# Altium schematic sheet DC-DC Converters.SchDoc
size B
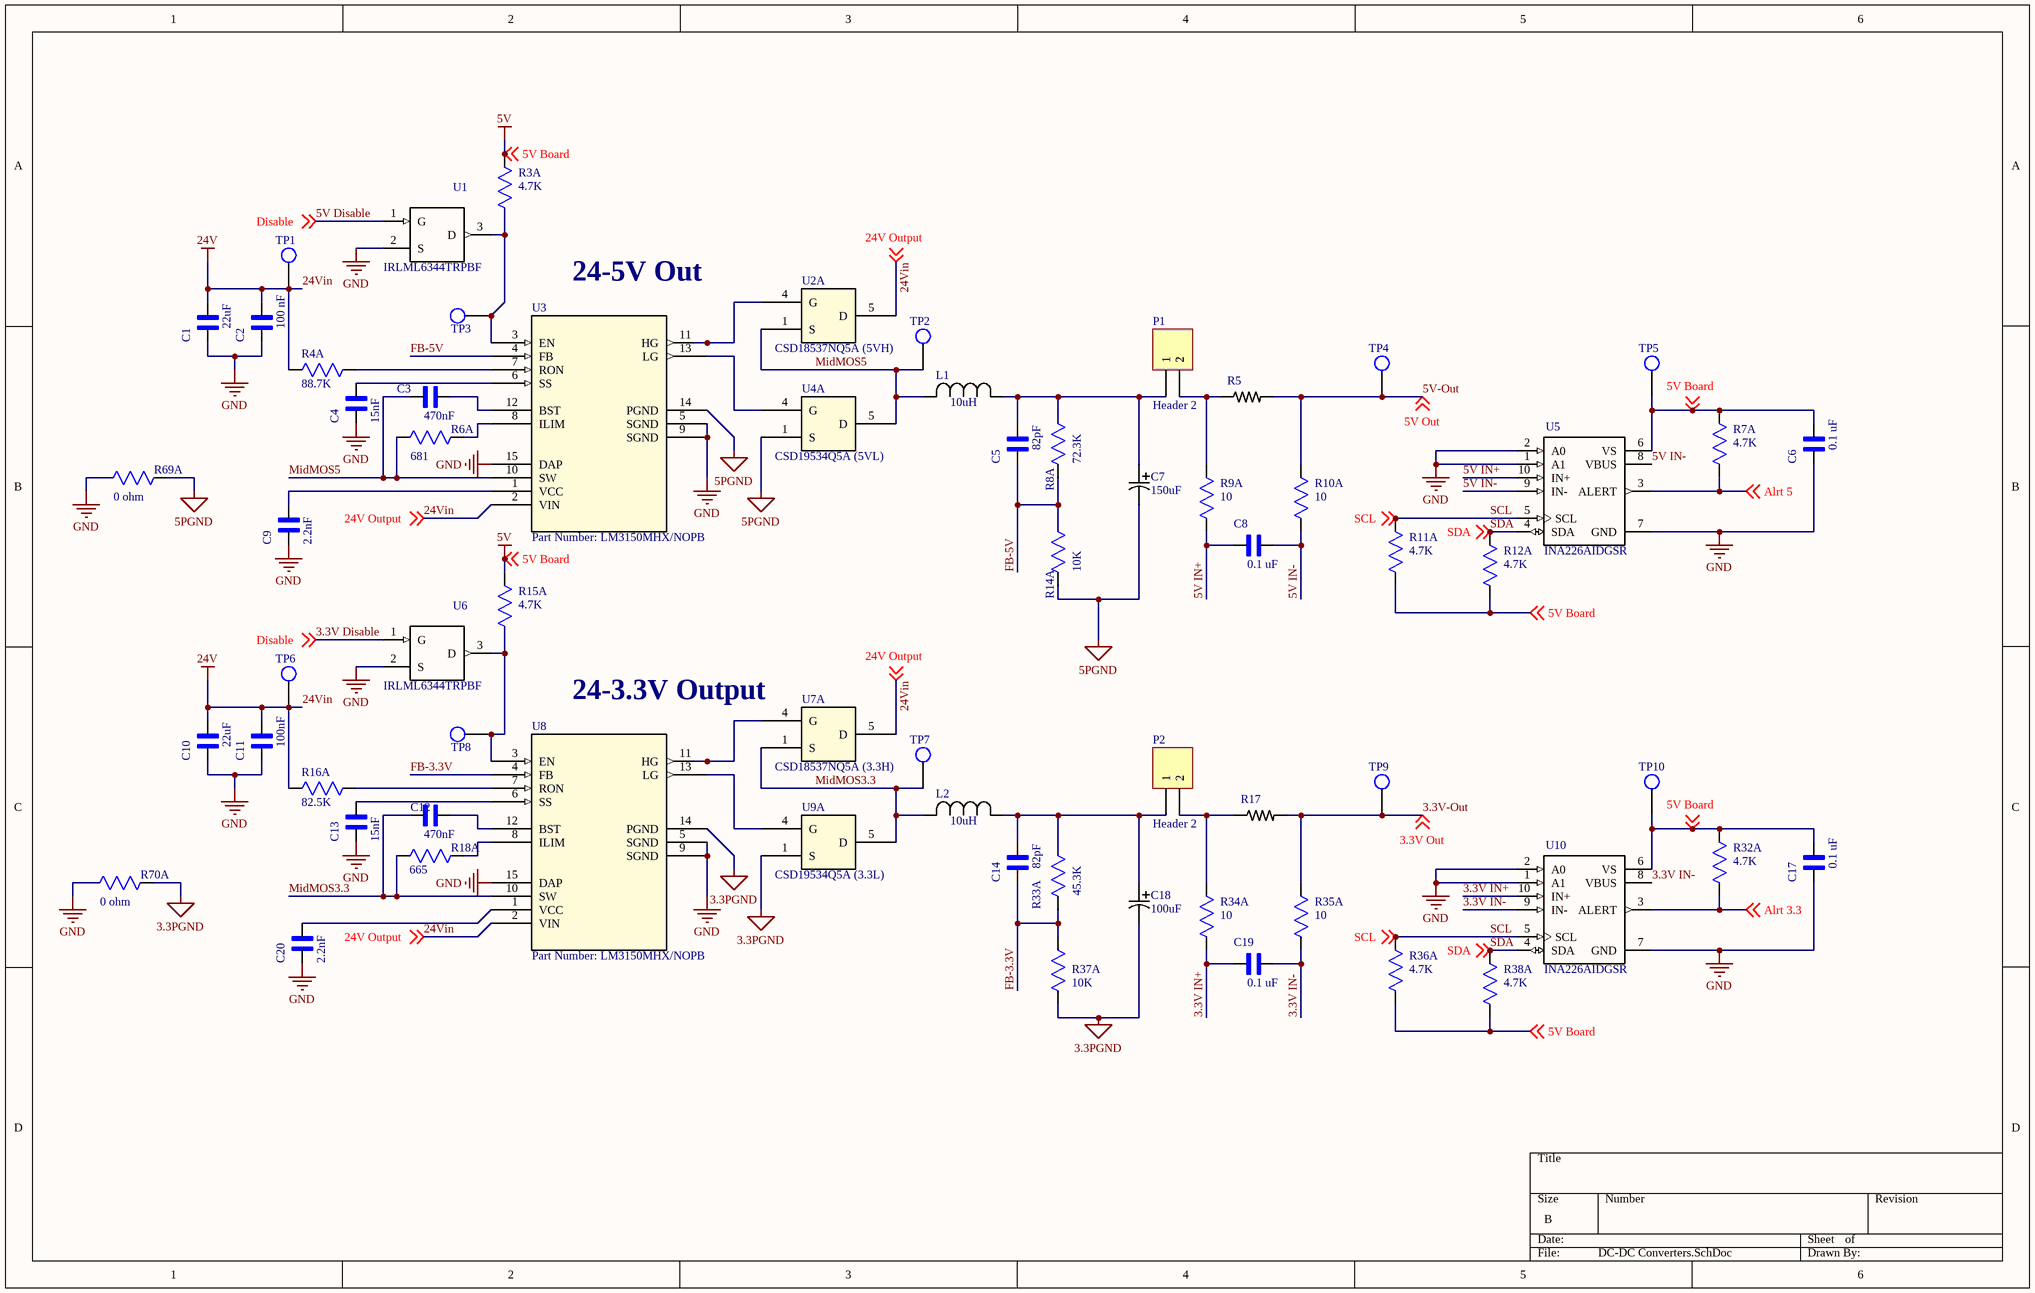
[diagram p0: DC-DC Converters.SchDoc]

## Parts
C1  22uF  [*CAPC2012X135N]
C2  100 nF  [*CAPC2012X135N]
C3  470nF  [*CAPC2012X135N]
C4  15nF  [*CAPC2012X135N]
C5  82pF  [*CAPC2012X135N]
C6  0.1 uF  [*CAPC2012X135N]
C7  150uF  [PCAP_TPE_B2]
C8  0.1 uF  [*CAPC2012X135N]
C9  2.2nF  [*CAPC2012X135N]
C10  22uF  [*CAPC2012X135N]
C11  100nF  [*CAPC2012X135N]
C12  470nF  [*CAPC2012X135N]
C13  15nF  [*CAPC2012X135N]
C14  82pF  [*CAPC2012X135N]
C17  0.1 uF  [*CAPC2012X135N]
C18  100uF  [PCAP_TPE_B2]
C19  0.1 uF  [*CAPC2012X135N]
C20  2.2nF  [*CAPC2012X135N]
L1  10uH  [IND_BOURNS_SRP12]
L2  10uH  [IND_BOURNS_SRP12]
P1  Header 2  [HDR1X2]
P2  Header 2  [HDR1X2]
R3  4.7K  [RC0805N]  (part A of 2)
R4  88.7K  [RC0805N]  (part A of 2)
R5  1-1879378-2  [*RESC6331X70N]  (value not drawn)
R6  681  [RC0805N]  (part A of 2)
R7  4.7K  [RC0805N]  (part A of 2)
R8  72.3K  [RC0805N]  (part A of 2)
R9  10  [RC0805N]  (part A of 2)
R10  10  [RC0805N]  (part A of 2)
R11  4.7K  [RC0805N]  (part A of 2)
R12  4.7K  [RC0805N]  (part A of 2)
R14  10K  [RC0805N]  (part A of 2)
R15  4.7K  [RC0805N]  (part A of 2)
R16  82.5K  [RC0805N]  (part A of 2)
R17  1-1879378-2  [*RESC6331X70N]  (value not drawn)
R18  665  [RC0805N]  (part A of 2)
R32  4.7K  [RC0805N]  (part A of 2)
R33  45.3K  [RC0805N]  (part A of 2)
R34  10  [RC0805N]  (part A of 2)
R35  10  [RC0805N]  (part A of 2)
R36  4.7K  [RC0805N]  (part A of 2)
R37  10K  [RC0805N]  (part A of 2)
R38  4.7K  [RC0805N]  (part A of 2)
R69  0 ohm  [RC0805N]  (part A of 2)
R70  0 ohm  [RC0805N]  (part A of 2)
TP1  Test Point  [Test Point Through-hole]  (value not drawn)
TP2  Test Point  [Test Point Through-hole]  (value not drawn)
TP3  Test Point  [Test Point Through-hole]  (value not drawn)
TP4  Test Point  [Test Point Through-hole]  (value not drawn)
TP5  Test Point  [Test Point Through-hole]  (value not drawn)
TP6  Test Point  [Test Point Through-hole]  (value not drawn)
TP7  Test Point  [Test Point Through-hole]  (value not drawn)
TP8  Test Point  [Test Point Through-hole]  (value not drawn)
TP9  Test Point  [Test Point Through-hole]  (value not drawn)
TP10  Test Point  [Test Point Through-hole]  (value not drawn)
U1  IRLML6344TRPBF  [*SOT95P240X112-3N]
U2  CSD18537NQ5A (5VH)  [*TRANS_BSC076N06NS3-G]  (part A of 2)
U3  Part Number: LM3150MHX/NOPB  [MXA14A]
U4  CSD19534Q5A (5VL)  [DQJ8]  (part A of 2)
U5  INA226AIDGSR  [*SOP50P490X110-10N]
U6  IRLML6344TRPBF  [*SOT95P240X112-3N]
U7  CSD18537NQ5A (3.3H)  [DQJ8]  (part A of 2)
U8  Part Number: LM3150MHX/NOPB  [MXA14A]
U9  CSD19534Q5A (3.3L)  [DQJ8]  (part A of 2)
U10  INA226AIDGSR  [*SOP50P490X110-10N]

## Nets
3.3PGND: C18.2 R70.1 U8.14(PGND) U9.1(S)
5PGND: C7.2 R14.1 R69.1 U3.14(PGND) U4.1(S)
5V: C6.2 C17.2 R3.1 R7.1 R15.1 R32.1 TP5.1 TP10.1 U5.6(VS) U10.6(VS) ; off-sheet 5V Board   [also labelled 5V Board ]
24Vin: C1.2 C2.2 C10.2 C11.2 TP1.1 TP6.1 U2.5(D) U3.2(VIN) U7.5(D) U8.2(VIN) ; off-sheet 24V Output   [also labelled 24V, 24V Output ]
GND: C1.1 C2.1 C4.1 C6.1 C9.1 C10.1 C11.1 C13.1 C17.1 C20.1 R69.2 R70.2 U1.2(S) U3.5(SGND) U3.9(SGND) U3.15(DAP) U5.1(A1) U5.2(A0) U5.7(GND) U6.2(S) U8.5(SGND) U8.9(SGND) U8.15(DAP) U10.1(A1) U10.2(A0) U10.7(GND)
3.3V Disable: U1.1(G) U6.1(G) ; off-sheet Disable   [also labelled 5V Disable, Disable ]
3.3V IN+: C19.1 U10.10(IN+)
3.3V IN-: C19.2 U10.8(VBUS) U10.9(IN-)
3.3V-Out: R17.2 R35.1 TP9.1 ; off-sheet 3.3V Out  [also labelled 3.3V Out]
5V IN+: C8.1 U5.10(IN+)
5V IN-: C8.2 U5.8(VBUS) U5.9(IN-)
5V-Out: R5.2 R10.1 TP4.1 ; off-sheet 5V Out  [also labelled 5V Out]
Alrt 3.3: U10.3(ALERT) ; off-sheet Alrt 3.3
Alrt 5: U5.3(ALERT) ; off-sheet Alrt 5
FB-3.3V: C14.1 R33.1 R37.1 U8.4(FB)
FB-5V: C5.1 R8.1 R14.2 U3.4(FB)
MidMOS3.3: C12.1 L2.2 TP7.1 U7.1(S) U8.10(SW) U9.5(D)
MidMOS5: C3.1 L1.2 TP2.1 U2.1(S) U3.10(SW) U4.5(D)
SCL: R11.1 R36.1 U5.5(SCL) U10.5(SCL) ; off-sheet SCL
SDA: R12.1 R38.1 U5.4(SDA) U10.4(SDA) ; off-sheet SDA
NetC3_2: C3.2 U3.12(BST)
NetC4_2: C4.2 U3.6(SS)
NetC5_2: C5.2 C7.1 L1.1 P1.1 R8.2
NetC9_2: C9.2 U3.1(VCC)
NetC12_2: C12.2 U8.12(BST)
NetC13_2: C13.2 U8.6(SS)
NetC14_2: C14.2 C18.1 L2.1 P2.1 R33.2
NetC20_2: C20.2 U8.1(VCC)
NetP1_2: P1.2 R5.1 R9.1
NetP2_2: P2.2 R17.1 R34.1
NetR3_2: R3.2 TP3.1 U1.3(D) U3.3(EN)
NetR4_1: R4.1 U3.7(RON)
NetR6_1: R6.1 U3.8(ILIM)
NetR15_2: R15.2 TP8.1 U6.3(D) U8.3(EN)
NetR16_1: R16.1 U8.7(RON)
NetR18_1: R18.1 U8.8(ILIM)
NetU2_4: U2.4(G) U3.11(HG)
NetU3_13: U3.13(LG) U4.4(G)
NetU7_4: U7.4(G) U8.11(HG)
NetU8_13: U8.13(LG) U9.4(G)

Not connected (* = marked no-connect by the designer): R4 2; R6 2; R7 2; R9 2; R10 2; R11 2; R12 2; R16 2; R18 2; R32 2; R34 2; R35 2; R36 2; R37 2; R38 2

## Notes on the sheet
- 24-5V Out
- (near U7) 24-3.3V Output

## Library data of the parts
C1-C6 C8-C14 C17 C19 C20 = EMK212BJ225KG-T: / Cap Ceramic 2.2uF 16V X5R 10% SMD 0805 125Â°C Embossed T/R /; MF: Taiyo Yuden; MP: EMK212BJ225KG-T; Package: 2012 Taiyo Yuden; Digi-Key_Purchase_URL: https://www.digikey.com/product-detail/en/taiyo-yuden/EMK212BJ225KG-T/587-1293-1-ND/931070?utm_source=snapeda&utm_medium=aggregator&utm_campaign=symbol; Digi-Key_Part_Number: 587-1293-1-ND; SnapEDA_Link: https://www.snapeda.com/parts/EMK212BJ225KG-T/Taiyo%20Yuden/view-part/?ref=snap; Value: *
C7 C18 = 6TPE150MAPB: No Description Available; Vendor: Panasonic; Built_By: EMA_UL_Team; Type: DEV; Manufacturer_Part_Number: 6TPE150MAPB; Copyright: Copyright (C) 2018 Accelerated Designs. All rights reserved; RefDes: RefDes; Value: Value
L1 L2 = SRP1250-100M: No Description Available; Vendor: Bourns Electronics; Built_By: EMA_UL_Team; Type: DEV; Manufacturer_Part_Number: SRP1250-100M; Copyright: Copyright (C) 2018 Accelerated Designs. All rights reserved; RefDes: RefDes; Value: Value
P1 P2 = Header 2: Header, 2-Pin; LatestRevisionDate: 17-Jul-2002; LatestRevisionNote: Re-released for DXP Platform.; Publisher: Altium Limited
R3 R4 R6-R12 R14-R16 R18 R32-R38 R69 R70 = CRCW0805681RFKEA: No Description Available; Manufacturer_Part_Number: CRCW0805681RFKEA_1; Vendor: Vishay; Built_By: EMA_UL_Team; Copyright: Copyright (C) 2018 Accelerated Designs. All rights reserved; RefDes: RefDes; Type: DEV; Value: Value
R5 R17 = TLR3A20KR003FTDG: TLR 2512 2.0W R003 1% 150PPM 2K RL; Power_Rating: 2 W; MF: TE Connectivity; Resistance: .003; MP: TLR3A20KR003FTDG; Digi-Key_Purchase_URL: https://www.digikey.com/product-detail/en/te-connectivity-passive-product/TLR3A20KR003FTDG/A131783CT-ND/8603913?utm_source=snapeda&utm_medium=aggregator&utm_campaign=symbol; SnapEDA_Link: https://www.snapeda.com/parts/TLR3A20KR003FTDG/TE%20Connectivity/view-part/1169417/?ref=snap; TE_purchase_URL: https://www.te.com/usa-en/product-1-1879378-2.html?te_bu=Cor&te_type=disp&te_campaign=seda_glo_cor-seda-global-disp-prtnr-fy19-seda-model-bom-cta_sma-317_1&elqCampaignId=32493; Package: 2512; Digi-Key_Part_Number: A131783CT-ND; EU_RoHS_Compliance: Compliant; Tolerance: 1%; Value: *
U1 U6 = IRLML6344TRPBF: IRLML6344TRPBF N-channel MOSFET Transistor, 5 A, 30 V, 3-Pin SOT-23; MF: Infineon Technologies; Package: SOT-23 Infineon; SnapEDA_Link: https://www.snapeda.com/parts/IRLML6344TRPBF/Infineon%20Technologies/view-part/?ref=snap; MP: IRLML6344TRPBF; Digi-Key_Purchase_URL: https://www.digikey.com/product-detail/en/infineon-technologies/IRLML6344TRPBF/IRLML6344TRPBFCT-ND/2538168?utm_source=snapeda&utm_medium=aggregator&utm_campaign=symbol; Digi-Key_Part_Number: IRLML6344TRPBFCT-ND; Value: *
U2 U7 = CSD18537NQ5A: No Description Available; Built_By: EMA_UL_Team; Vendor: Texas Instruments; Manufacturer_Part_Number: CSD18537NQ5A; Copyright: Copyright (C) 2018 Accelerated Designs. All rights reserved; RefDes: RefDes; Type: DEV; Value: Value
U3 U8 = LM3150MHX/NOPB: No Description Available; Vendor: Texas Instruments; Built_By: EMA_UL_Team; Manufacturer_Part_Number: LM3150MHX/NOPB; Copyright: Copyright (C) 2018 Accelerated Designs. All rights reserved; RefDes: RefDes; Type: DEV; Value: Value
U4 U9 = CSD19534Q5A: No Description Available; Built_By: EMA_UL_Team; Vendor: Texas Instruments; Manufacturer_Part_Number: CSD19534Q5A; Copyright: Copyright (C) 2018 Accelerated Designs. All rights reserved; RefDes: RefDes; Type: DEV; Value: Value
U5 U10 = INA226AIDGSR: Current Monitor Regulator High/Low-Side 10mA 10-VSSOP; MF: Texas Instruments; Digi-Key_Part_Number: 296-29034-1-ND; SnapEDA_Link: https://www.snapeda.com/parts/INA226AIDGSR/Texas%20Instruments/view-part/53552/?ref=snap; Package: MSOP-10 Texas Instruments; MP: INA226AIDGSR; Digi-Key_Purchase_URL: https://www.digikey.com/product-detail/en/texas-instruments/INA226AIDGSR/296-29034-1-ND/2687118?utm_source=snapeda&utm_medium=aggregator&utm_campaign=symbol; Value: *